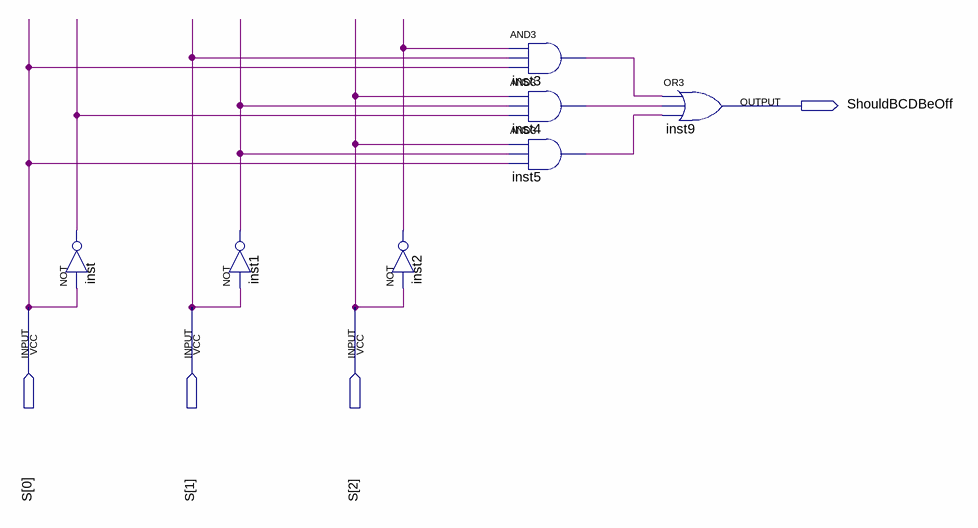
[diagram p0: schematic sheet]
// Quartus schematic ShouldBCDBeActivated.bdf as structural Verilog: 7 symbols, 4 pins
module ShouldBCDBeActivated (
  input  [2:0] S,
  output ShouldBCDBeOff
);

  wire inst1_out, inst2_out, inst3_out, inst4_out, inst5_out, inst_out;

  not inst (inst_out, S[0]);
  not inst1 (inst1_out, S[1]);
  not inst2 (inst2_out, S[2]);
  and inst3 (inst3_out, inst2_out, S[1], S[0]);
  and inst4 (inst4_out, S[2], inst1_out, inst_out);
  and inst5 (inst5_out, S[2], inst1_out, S[0]);
  or inst9 (ShouldBCDBeOff, inst3_out, inst4_out, inst5_out);
endmodule
